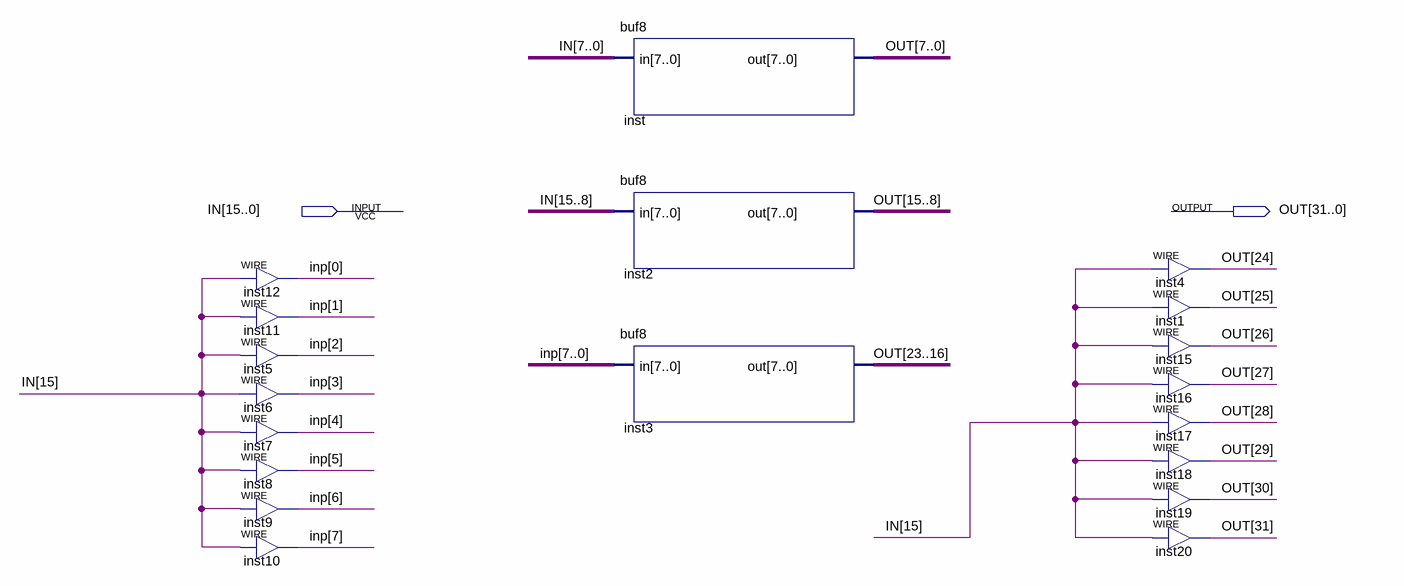
[diagram p0: schematic sheet]
// Quartus schematic shifter16T32signed.bdf as structural Verilog: 19 symbols, 2 pins
module shifter16T32signed (
  input  [15:0] IN,
  output [31:0] OUT
);

  wire [7:0] inp;

  assign inp[0] = IN[15];  // WIRE inst12
  assign inp[1] = IN[15];  // WIRE inst11
  assign inp[2] = IN[15];  // WIRE inst5
  assign inp[3] = IN[15];  // WIRE inst6
  assign inp[4] = IN[15];  // WIRE inst7
  assign inp[5] = IN[15];  // WIRE inst8
  assign inp[6] = IN[15];  // WIRE inst9
  assign inp[7] = IN[15];  // WIRE inst10
  buf8 inst (.in(IN[7:0]), .out(OUT[7:0]));
  buf8 inst2 (.in(IN[15:8]), .out(OUT[15:8]));
  buf8 inst3 (.in(inp), .out(OUT[23:16]));
  assign OUT[24] = IN[15];  // WIRE inst4
  assign OUT[25] = IN[15];  // WIRE inst1
  assign OUT[26] = IN[15];  // WIRE inst15
  assign OUT[27] = IN[15];  // WIRE inst16
  assign OUT[28] = IN[15];  // WIRE inst17
  assign OUT[29] = IN[15];  // WIRE inst18
  assign OUT[30] = IN[15];  // WIRE inst19
  assign OUT[31] = IN[15];  // WIRE inst20
endmodule
